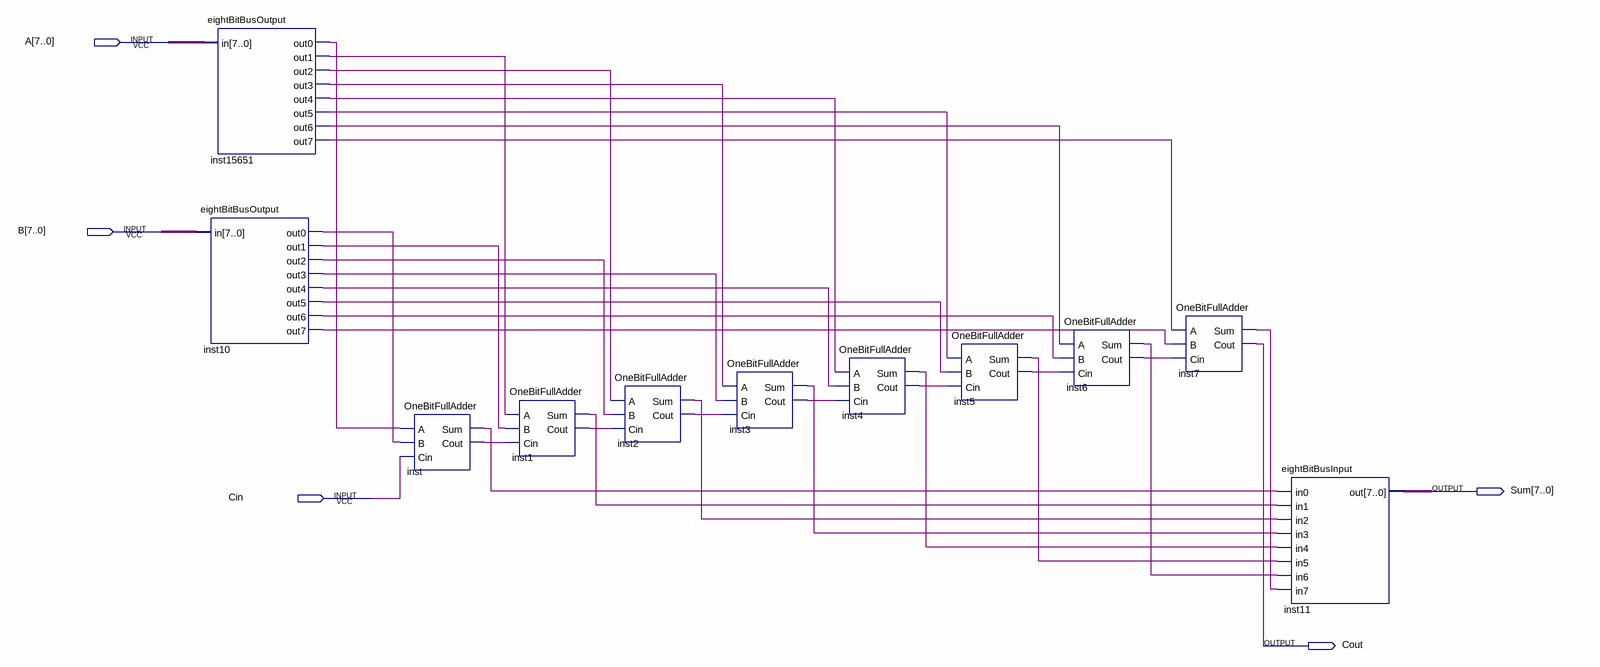
[diagram p0: schematic sheet]
// Quartus schematic EightBitFullAdder.bdf as structural Verilog: 11 symbols, 5 pins
module EightBitFullAdder (
  input  [7:0] A,
  input  [7:0] B,
  input  Cin,
  output [7:0] Sum,
  output Cout
);

  wire inst1_cout, inst1_sum, inst2_cout, inst2_sum, inst3_cout, inst3_sum, inst4_cout, inst4_sum,
       inst5_cout, inst5_sum, inst6_cout, inst6_sum, inst7_sum, inst10_out0, inst10_out1, inst10_out2,
       inst10_out3, inst10_out4, inst10_out5, inst10_out6, inst10_out7, inst15651_out0, inst15651_out1,
       inst15651_out2, inst15651_out3, inst15651_out4, inst15651_out5, inst15651_out6, inst15651_out7,
       inst_cout, inst_sum;

  eightBitBusOutput inst15651 (
    .in(A), .out0(inst15651_out0), .out1(inst15651_out1), .out2(inst15651_out2), .out3(inst15651_out3),
    .out4(inst15651_out4), .out5(inst15651_out5), .out6(inst15651_out6), .out7(inst15651_out7));
  eightBitBusOutput inst10 (
    .in(B), .out0(inst10_out0), .out1(inst10_out1), .out2(inst10_out2), .out3(inst10_out3),
    .out4(inst10_out4), .out5(inst10_out5), .out6(inst10_out6), .out7(inst10_out7));
  OneBitFullAdder inst (.A(inst15651_out0), .B(inst10_out0), .Cin(Cin), .Sum(inst_sum), .Cout(inst_cout));
  OneBitFullAdder inst1 (.A(inst15651_out1), .B(inst10_out1), .Cin(inst_cout), .Sum(inst1_sum), .Cout(inst1_cout));
  OneBitFullAdder inst2 (.A(inst15651_out2), .B(inst10_out2), .Cin(inst1_cout), .Sum(inst2_sum), .Cout(inst2_cout));
  OneBitFullAdder inst3 (.A(inst15651_out3), .B(inst10_out3), .Cin(inst2_cout), .Sum(inst3_sum), .Cout(inst3_cout));
  OneBitFullAdder inst4 (.A(inst15651_out4), .B(inst10_out4), .Cin(inst3_cout), .Sum(inst4_sum), .Cout(inst4_cout));
  OneBitFullAdder inst5 (.A(inst15651_out5), .B(inst10_out5), .Cin(inst4_cout), .Sum(inst5_sum), .Cout(inst5_cout));
  OneBitFullAdder inst6 (.A(inst15651_out6), .B(inst10_out6), .Cin(inst5_cout), .Sum(inst6_sum), .Cout(inst6_cout));
  OneBitFullAdder inst7 (.A(inst15651_out7), .B(inst10_out7), .Cin(inst6_cout), .Sum(inst7_sum), .Cout(Cout));
  eightBitBusInput inst11 (
    .in0(inst_sum), .in1(inst1_sum), .in2(inst2_sum), .in3(inst3_sum), .in4(inst4_sum), .in5(inst5_sum),
    .in6(inst6_sum), .in7(inst7_sum), .out(Sum));
endmodule
